# Altium schematic sheet DSO_Power.SchDoc: Schematic_Name
size A4; CompanyName: University of Melbourne; Engineer: Your Name Here; DocumentNumber: 1; Revision: 0.1; SheetNumber: 1; SheetTotal: 1; Title_Project: Project_Title; StudentNo: Student No.
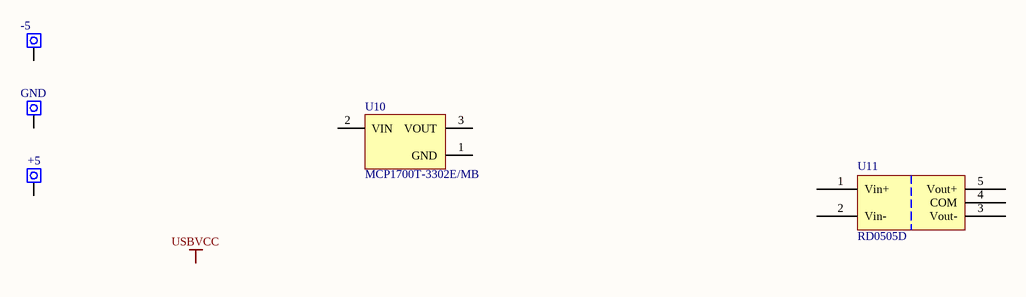
[diagram p0: DSO_Power.SchDoc]

## Parts
TP4  -5  [PIN 1.8mm]
TP5  GND  [PIN 1.8mm]
TP6  +5  [PIN 1.8mm]
U10  MCP1700T-3302E/MB  [SOT89]
U11  RD0505D  [SIP_NMG]

## Nets

Not connected (* = marked no-connect by the designer): TP4 1; TP5 1; TP6 1; U10 1(GND) 2(VIN) 3(VOUT); U11 1(Vin+) 2(Vin-) 3(Vout-) 4(COM) 5(Vout+)

## Notes on the sheet
- Labels drawn without touching a wire or pin: USBVCC

## Library data of the parts
TP4-TP6 = WIRE: Pad
U10 = MCP1700T: Low Quiescent Current LDO, 3-Pin SOT-89, Extended Temperature, Tape and Reel; Reviewed by: RM - 2018/08/05; Supplier 1: Digi-Key; Supplier Part Number 1: MCP1700T3302EMBCT-ND
U11 = RD0505D: (ADV) DC to DC converter 5V in +-5V out; Reviewed by: RM - 2018/08/05; Supplier Part Number 1: 945-1136-ND; Supplier 1: Digi-Key